# Altium schematic sheet 2_waffling80-MXHS_matrix.SchDoc
size A2
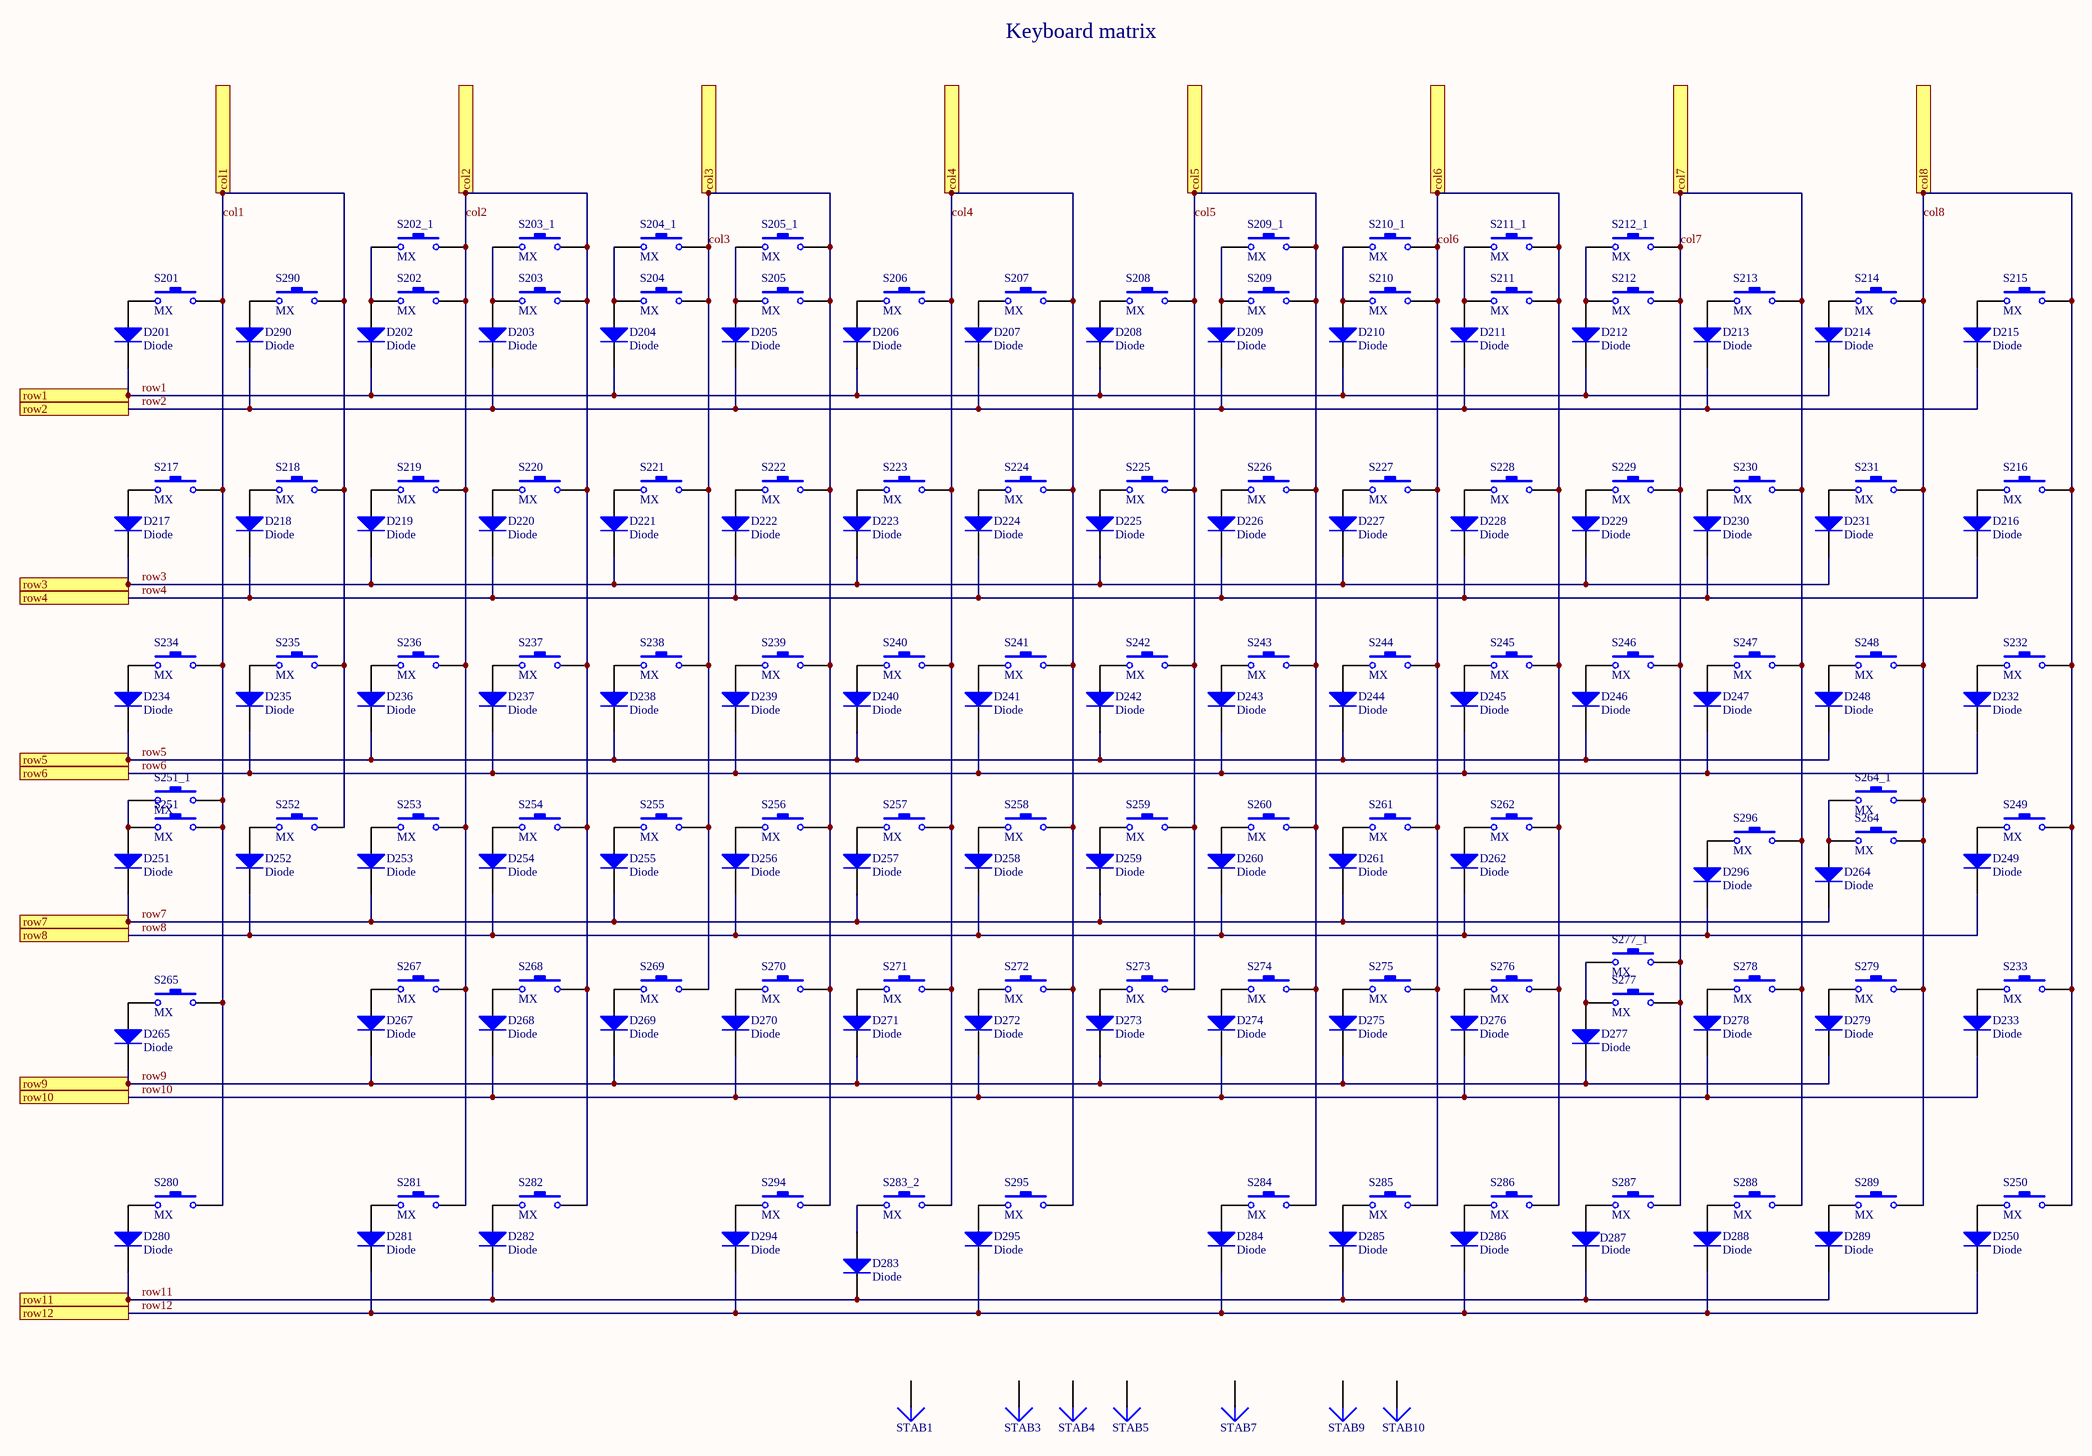
[diagram p0: 2_waffling80-MXHS_matrix.SchDoc]

## Parts
D201  Diode  [SOD-123]
D202  Diode  [SOD-123]
D203  Diode  [SOD-123]
D204  Diode  [SOD-123]
D205  Diode  [SOD-123]
D206  Diode  [SOD-123]
D207  Diode  [SOD-123]
D208  Diode  [SOD-123]
D209  Diode  [SOD-123]
D210  Diode  [SOD-123]
D211  Diode  [SOD-123]
D212  Diode  [SOD-123]
D213  Diode  [SOD-123]
D214  Diode  [SOD-123]
D215  Diode  [SOD-123]
D216  Diode  [SOD-123]
D217  Diode  [SOD-123]
D218  Diode  [SOD-123]
D219  Diode  [SOD-123]
D220  Diode  [SOD-123]
D221  Diode  [SOD-123]
D222  Diode  [SOD-123]
D223  Diode  [SOD-123]
D224  Diode  [SOD-123]
D225  Diode  [SOD-123]
D226  Diode  [SOD-123]
D227  Diode  [SOD-123]
D228  Diode  [SOD-123]
D229  Diode  [SOD-123]
D230  Diode  [SOD-123]
D231  Diode  [SOD-123]
D232  Diode  [SOD-123]
D233  Diode  [SOD-123]
D234  Diode  [SOD-123]
D235  Diode  [SOD-123]
D236  Diode  [SOD-123]
D237  Diode  [SOD-123]
D238  Diode  [SOD-123]
D239  Diode  [SOD-123]
D240  Diode  [SOD-123]
D241  Diode  [SOD-123]
D242  Diode  [SOD-123]
D243  Diode  [SOD-123]
D244  Diode  [SOD-123]
D245  Diode  [SOD-123]
D246  Diode  [SOD-123]
D247  Diode  [SOD-123]
D248  Diode  [SOD-123]
D249  Diode  [SOD-123]
D250  Diode  [SOD-123]
D251  Diode  [SOD-123]
D252  Diode  [SOD-123]
D253  Diode  [SOD-123]
D254  Diode  [SOD-123]
D255  Diode  [SOD-123]
D256  Diode  [SOD-123]
D257  Diode  [SOD-123]
D258  Diode  [SOD-123]
D259  Diode  [SOD-123]
D260  Diode  [SOD-123]
D261  Diode  [SOD-123]
D262  Diode  [SOD-123]
D264  Diode  [SOD-123]
D265  Diode  [SOD-123]
D267  Diode  [SOD-123]
D268  Diode  [SOD-123]
D269  Diode  [SOD-123]
D270  Diode  [SOD-123]
D271  Diode  [SOD-123]
D272  Diode  [SOD-123]
D273  Diode  [SOD-123]
D274  Diode  [SOD-123]
D275  Diode  [SOD-123]
D276  Diode  [SOD-123]
D277  Diode  [SOD-123]
D278  Diode  [SOD-123]
D279  Diode  [SOD-123]
D280  Diode  [SOD-123]
D281  Diode  [SOD-123]
D282  Diode  [SOD-123]
D283  Diode  [SOD-123]
D284  Diode  [SOD-123]
D285  Diode  [SOD-123]
D286  Diode  [SOD-123]
D287  Diode  [SOD-123]
D288  Diode  [SOD-123]
D289  Diode  [SOD-123]
D290  Diode  [SOD-123]
D294  Diode  [SOD-123]
D295  Diode  [SOD-123]
D296  Diode  [SOD-123]
S201  MX  [MXHS-SWITCH - 1U TOP LAYER - AS2 - S3]
S202  MX  [MXHS-switch - 1U Top layer - switched pol AS2]
S202_1  MX  [MXHS-switch - 1U Top layer - AS2]
S203  MX  [MXHS-switch - 1U Top layer - switched pol AS2]
S203_1  MX  [MXHS-switch - 1U Top layer - switched pol AS2]
S204  MX  [MXHS-switch - 1U Top layer - switched pol AS2]
S204_1  MX  [MXHS-switch - 1U Top layer - AS2]
S205  MX  [MXHS-switch - 1U Top layer - switched pol AS2]
S205_1  MX  [MXHS-switch - 1U Top layer - AS2]
S206  MX  [MXHS-switch - 1U Top layer - AS2]
S207  MX  [MXHS-switch - 1U Top layer - AS2]
S208  MX  [MXHS-switch - 1U Top layer - AS2]
S209  MX  [MXHS-switch - 1U Top layer - switched pol AS2]
S209_1  MX  [MXHS-switch - 1U Top layer - switched pol AS2]
S210  MX  [MXHS-switch - 1U Top layer - AS2]
S210_1  MX  [MXHS-switch - 1U Top layer - switched pol AS2]
S211  MX  [MXHS-switch - 1U Top layer - AS2]
S211_1  MX  [MXHS-switch - 1U Top layer - AS2]
S212  MX  [MXHS-switch - 1U Top layer - AS2]
S212_1  MX  [MXHS-switch - 1U Top layer - switched pol AS2]
S213  MX  [MXHS-switch - 1U Top layer - AS2]
S214  MX  [MXHS-switch - 1U Top layer - switched pol AS2]
S215  MX  [MXHS-switch - 1U Top layer - AS2]
S216  MX  [MXHS-switch - 1U Top layer - AS2 - S4]
S217  MX  [MXHS-SWITCH - 1U TOP LAYER - AS2 - S3]
S218  MX  [MXHS-switch - 1U Top layer - switched pol AS2]
S219  MX  [MXHS-switch - 1U Top layer - switched pol AS2]
S220  MX  [MXHS-switch - 1U Top layer - switched pol AS2]
S221  MX  [MXHS-switch - 1U Top layer - switched pol AS2]
S222  MX  [MXHS-switch - 1U Top layer - switched pol AS2]
S223  MX  [MXHS-switch - 1U Top layer - switched pol AS2]
S224  MX  [MXHS-switch - 1U Top layer - switched pol AS2]
S225  MX  [MXHS-switch - 1U Top layer - switched pol AS2]
S226  MX  [MXHS-switch - 1U Top layer - switched pol AS2]
S227  MX  [MXHS-switch - 1U Top layer - switched pol AS2]
S228  MX  [MXHS-switch - 1U Top layer - switched pol AS2]
S229  MX  [MXHS-switch - 1U Top layer - switched pol AS2]
S230  MX  [MXHS-switch - 1U Top layer - switched pol AS2]
S231  MX  [MXHS-switch - 1U Top layer - AS2]
S232  MX  [MXHS-switch - 1U Top layer - AS2]
S233  MX  [MXHS-switch - 1U Top layer - AS2 - S4]
S234  MX  [MXHS-switch - 1U Top layer - switched pol AS2]
S235  MX  [MXHS-switch - 1U Top layer - switched pol AS2]
S236  MX  [MXHS-switch - 1U Top layer - switched pol AS2]
S237  MX  [MXHS-switch - 1U Top layer - switched pol AS2]
S238  MX  [MXHS-switch - 1U Top layer - switched pol AS2]
S239  MX  [MXHS-switch - 1U Top layer - switched pol AS2]
S240  MX  [MXHS-switch - 1U Top layer - switched pol AS2]
S241  MX  [MXHS-switch - 1U Top layer - switched pol AS2]
S242  MX  [MXHS-switch - 1U Top layer - switched pol AS2]
S243  MX  [MXHS-switch - 1U Top layer - switched pol AS2]
S244  MX  [MXHS-switch - 1U Top layer - switched pol AS2]
S245  MX  [MXHS-switch - 1U Top layer - switched pol AS2]
S246  MX  [MXHS-switch - 1U Top layer - switched pol AS2]
S247  MX  [MXHS-switch - 1U Top layer - AS2]
S248  MX  [MXHS-switch - 1U Top layer - AS2]
S249  MX  [MXHS-switch - 1U Top layer - AS2]
S250  MX  [MXHS-switch - 1U Top layer - AS2 - S4]
S251  MX  [MXHS-switch - 1U Top layer - switched pol AS2]
S251_1  MX  [MXHS-switch - 1U Top layer - AS2 - S1]
S252  MX  [MXHS-switch - 1U Top layer - switched pol AS2]
S253  MX  [MXHS-switch - 1U Top layer - switched pol AS2]
S254  MX  [MXHS-switch - 1U Top layer - switched pol AS2]
S255  MX  [MXHS-switch - 1U Top layer - switched pol AS2]
S256  MX  [MXHS-switch - 1U Top layer - switched pol AS2]
S257  MX  [MXHS-switch - 1U Top layer - switched pol AS2]
S258  MX  [MXHS-switch - 1U Top layer - switched pol AS2]
S259  MX  [MXHS-switch - 1U Top layer - switched pol AS2]
S260  MX  [MXHS-switch - 1U Top layer - switched pol AS2]
S261  MX  [MXHS-switch - 1U Top layer - AS2]
S262  MX  [MXHS-switch - 1U Top layer - switched pol AS2]
S264  MX  [MXHS-switch - 1U Top layer - switched pol AS2]
S264_1  MX  [MXHS-switch - 1U Top layer - switched pol AS2]
S265  MX  [MXHS-switch - 1U Top layer - AS2]
S267  MX  [MXHS-switch - 1U Top layer - switched pol AS2]
S268  MX  [MXHS-switch - 1U Top layer - switched pol AS2]
S269  MX  [MXHS-switch - 1U Top layer - switched pol AS2]
S270  MX  [MXHS-switch - 1U Top layer - switched pol AS2]
S271  MX  [MXHS-switch - 1U Top layer - switched pol AS2]
S272  MX  [MXHS-switch - 1U Top layer - switched pol AS2]
S273  MX  [MXHS-switch - 1U Top layer - switched pol AS2]
S274  MX  [MXHS-switch - 1U Top layer - switched pol AS2]
S275  MX  [MXHS-switch - 1U Top layer - switched pol AS2]
S276  MX  [MXHS-switch - 1U Top layer - switched pol AS2]
S277  MX  [MXHS-switch - 1U Top layer - AS2 - S2]
S277_1  MX  [MXHS-switch - 1U Top layer - AS2 - S2]
S278  MX  [MXHS-switch - 1U Top layer - AS2]
S279  MX  [MXHS-switch - 1U Top layer - AS2]
S280  MX  [MXHS-switch - 1U Top layer - switched pol AS2]
S281  MX  [MXHS-switch - 1U Top layer - switched pol AS2]
S282  MX  [MXHS-switch - 1U Top layer - switched pol AS2]
S283_2  MX  [MXHS-switch - 1U Top layer - switched pol AS2]
S284  MX  [MXHS-switch - 1U Top layer - switched pol AS2]
S285  MX  [MXHS-switch - 1U Top layer - switched pol AS2]
S286  MX  [MXHS-switch - 1U Top layer - switched pol AS2]
S287  MX  [MXHS-switch - 1U Top layer - AS2]
S288  MX  [MXHS-switch - 1U Top layer - AS2]
S289  MX  [MXHS-switch - 1U Top layer - AS2 - S4]
S290  MX  [MXHS-switch - 1U Top layer - switched pol AS2]
S294  MX  [MXHS-switch - 1U Top layer - switched pol AS2]
S295  MX  [MXHS-switch - 1U Top layer - AS2]
S296  MX  [MXHS-switch - 1U Top layer - switched pol AS2]
STAB1  Plug  [Stab 2u]  (value not drawn)  (no BOM)
STAB3  Plug  [Stab 2u]  (value not drawn)  (no BOM)
STAB4  Plug  [Stab 2u]  (value not drawn)  (no BOM)
STAB5  Plug  [Stab 2u]  (value not drawn)  (no BOM)
STAB7  Plug  [Stab 7U]  (value not drawn)  (no BOM)
STAB9  Plug  [Stab 3u]  (value not drawn)  (no BOM)
STAB10  Plug  [Stab 3u]  (value not drawn)  (no BOM)

## Ports
col1, col2, col3, col4, col5, col6, col7, col8, row1, row2, row3, row4, row5, row6, row7, row8, row9, row10, row11, row12

## Nets
col1: S201.2 S217.2 S218.1 S234.1 S235.1 S251.2 S251_1.1 S252.1 S265.2 S280.1 S290.1 ; port col1
col2: S202.2 S202_1.1 S203.2 S203_1.2 S219.1 S220.1 S236.1 S237.1 S253.1 S254.1 S267.1 S268.1 S281.1 S282.1 ; port col2
col3: S204.2 S204_1.2 S205.1 S205_1.1 S221.1 S222.1 S238.1 S239.1 S255.1 S256.1 S269.1 S270.1 S294.1 ; port col3
col4: S206.1 S207.1 S223.1 S224.1 S240.1 S241.1 S257.1 S258.1 S271.1 S272.1 S283_2.2 S295.2 ; port col4
col5: S208.1 S209.2 S209_1.2 S225.1 S226.1 S242.1 S243.1 S259.1 S260.1 S273.1 S274.1 S284.2 ; port col5
col6: S210.1 S210_1.2 S211.2 S211_1.2 S227.1 S228.1 S244.1 S245.1 S261.1 S262.1 S275.1 S276.1 S285.2 S286.2 ; port col6
col7: S212.2 S212_1.2 S213.1 S229.1 S230.1 S246.1 S247.1 S277.1 S277_1.2 S278.1 S287.1 S288.1 S296.1 ; port col7
col8: S214.1 S215.1 S216.1 S231.1 S232.1 S233.1 S248.1 S249.1 S250.1 S264.1 S264_1.1 S279.1 S289.1 ; port col8
row1: D201.2(K) D202.2(K) D204.2(K) D206.2(K) D208.2(K) D210.2(K) D212.2(K) D214.2(K) ; port row1
row2: D203.2(K) D205.2(K) D207.2(K) D209.2(K) D211.2(K) D213.2(K) D215.2(K) D290.2(K) ; port row2
row3: D217.2(K) D219.2(K) D221.2(K) D223.2(K) D225.2(K) D227.2(K) D229.2(K) D231.2(K) ; port row3
row4: D216.2(K) D218.2(K) D220.2(K) D222.2(K) D224.2(K) D226.2(K) D228.2(K) D230.2(K) ; port row4
row5: D234.2(K) D236.2(K) D238.2(K) D240.2(K) D242.2(K) D244.2(K) D246.2(K) D248.2(K) ; port row5
row6: D232.2(K) D235.2(K) D237.2(K) D239.2(K) D241.2(K) D243.2(K) D245.2(K) D247.2(K) ; port row6
row7: D251.2(K) D253.2(K) D255.2(K) D257.2(K) D259.2(K) D261.2(K) D264.2(K) ; port row7
row8: D249.2(K) D252.2(K) D254.2(K) D256.2(K) D258.2(K) D260.2(K) D262.2(K) D296.2(K) ; port row8
row9: D265.2(K) D267.2(K) D269.2(K) D271.2(K) D273.2(K) D275.2(K) D277.2(K) D279.2(K) ; port row9
row10: D233.2(K) D268.2(K) D270.2(K) D272.2(K) D274.2(K) D276.2(K) D278.2(K) ; port row10
row11: D280.2(K) D282.2(K) D283.2(K) D285.2(K) D287.2(K) D289.2(K) ; port row11
row12: D250.2(K) D281.2(K) D284.2(K) D286.2(K) D288.2(K) D294.2(K) D295.2(K) ; port row12
NetD201_1: D201.1(A) S201.1
NetD202_1: D202.1(A) S202.1 S202_1.2
NetD203_1: D203.1(A) S203.1 S203_1.1
NetD204_1: D204.1(A) S204.1 S204_1.1
NetD205_1: D205.1(A) S205.2 S205_1.2
NetD206_1: D206.1(A) S206.2
NetD207_1: D207.1(A) S207.2
NetD208_1: D208.1(A) S208.2
NetD209_1: D209.1(A) S209.1 S209_1.1
NetD210_1: D210.1(A) S210.2 S210_1.1
NetD211_1: D211.1(A) S211.1 S211_1.1
NetD212_1: D212.1(A) S212.1 S212_1.1
NetD213_1: D213.1(A) S213.2
NetD214_1: D214.1(A) S214.2
NetD215_1: D215.1(A) S215.2
NetD216_1: D216.1(A) S216.2
NetD217_1: D217.1(A) S217.1
NetD218_1: D218.1(A) S218.2
NetD219_1: D219.1(A) S219.2
NetD220_1: D220.1(A) S220.2
NetD221_1: D221.1(A) S221.2
NetD222_1: D222.1(A) S222.2
NetD223_1: D223.1(A) S223.2
NetD224_1: D224.1(A) S224.2
NetD225_1: D225.1(A) S225.2
NetD226_1: D226.1(A) S226.2
NetD227_1: D227.1(A) S227.2
NetD228_1: D228.1(A) S228.2
NetD229_1: D229.1(A) S229.2
NetD230_1: D230.1(A) S230.2
NetD231_1: D231.1(A) S231.2
NetD232_1: D232.1(A) S232.2
NetD233_1: D233.1(A) S233.2
NetD234_1: D234.1(A) S234.2
NetD235_1: D235.1(A) S235.2
NetD236_1: D236.1(A) S236.2
NetD237_1: D237.1(A) S237.2
NetD238_1: D238.1(A) S238.2
NetD239_1: D239.1(A) S239.2
NetD240_1: D240.1(A) S240.2
NetD241_1: D241.1(A) S241.2
NetD242_1: D242.1(A) S242.2
NetD243_1: D243.1(A) S243.2
NetD244_1: D244.1(A) S244.2
NetD245_1: D245.1(A) S245.2
NetD246_1: D246.1(A) S246.2
NetD247_1: D247.1(A) S247.2
NetD248_1: D248.1(A) S248.2
NetD249_1: D249.1(A) S249.2
NetD250_1: D250.1(A) S250.2
NetD251_1: D251.1(A) S251.1 S251_1.2
NetD252_1: D252.1(A) S252.2
NetD253_1: D253.1(A) S253.2
NetD254_1: D254.1(A) S254.2
NetD255_1: D255.1(A) S255.2
NetD256_1: D256.1(A) S256.2
NetD257_1: D257.1(A) S257.2
NetD258_1: D258.1(A) S258.2
NetD259_1: D259.1(A) S259.2
NetD260_1: D260.1(A) S260.2
NetD261_1: D261.1(A) S261.2
NetD262_1: D262.1(A) S262.2
NetD264_1: D264.1(A) S264.2 S264_1.2
NetD265_1: D265.1(A) S265.1
NetD267_1: D267.1(A) S267.2
NetD268_1: D268.1(A) S268.2
NetD269_1: D269.1(A) S269.2
NetD270_1: D270.1(A) S270.2
NetD271_1: D271.1(A) S271.2
NetD272_1: D272.1(A) S272.2
NetD273_1: D273.1(A) S273.2
NetD274_1: D274.1(A) S274.2
NetD275_1: D275.1(A) S275.2
NetD276_1: D276.1(A) S276.2
NetD277_1: D277.1(A) S277.2 S277_1.1
NetD278_1: D278.1(A) S278.2
NetD279_1: D279.1(A) S279.2
NetD280_1: D280.1(A) S280.2
NetD281_1: D281.1(A) S281.2
NetD282_1: D282.1(A) S282.2
NetD283_1: D283.1(A) S283_2.1
NetD284_1: D284.1(A) S284.1
NetD285_1: D285.1(A) S285.1
NetD286_1: D286.1(A) S286.1
NetD287_1: D287.1(A) S287.2
NetD288_1: D288.1(A) S288.2
NetD289_1: D289.1(A) S289.2
NetD290_1: D290.1(A) S290.2
NetD294_1: D294.1(A) S294.2
NetD295_1: D295.1(A) S295.1
NetD296_1: D296.1(A) S296.2

Not connected (* = marked no-connect by the designer): STAB1 1; STAB3 1; STAB4 1; STAB5 1; STAB7 1; STAB9 1; STAB10 1

## Notes on the sheet
- Keyboard matrix

## Library data of the parts
D201-D262 D264 D265 D267-D290 D294-D296 = Diode: Default Diode; MRF.Part: 1N4148W; LCSC MFG: ST(Semtech); Version: SOD-123; LCSC Part #: C81598
S201 S202 S202_1 S203 S203_1 S204 S204_1 S205 S205_1 S206-S209 S209_1 S210 S210_1 S211 S211_1 S212 S212_1 S213-S233 S235-S251 S251_1 S252-S262 S264 S264_1 S265 S267-S277 S277_1 S278-S282 S283_2 S284-S290 S294-S296 = SW-PB: Switch; MRF.Part: CPG151101S11-16; LCSC MFG: Kailh; LCSC Part #: C5156480
S234 = SW-PB: TAB; MRF.Part: CPG151101S11-16; LCSC MFG: Kailh; LCSC Part #: C5156480